# EAGLE design relay_board (EAGLE 7.7.0)
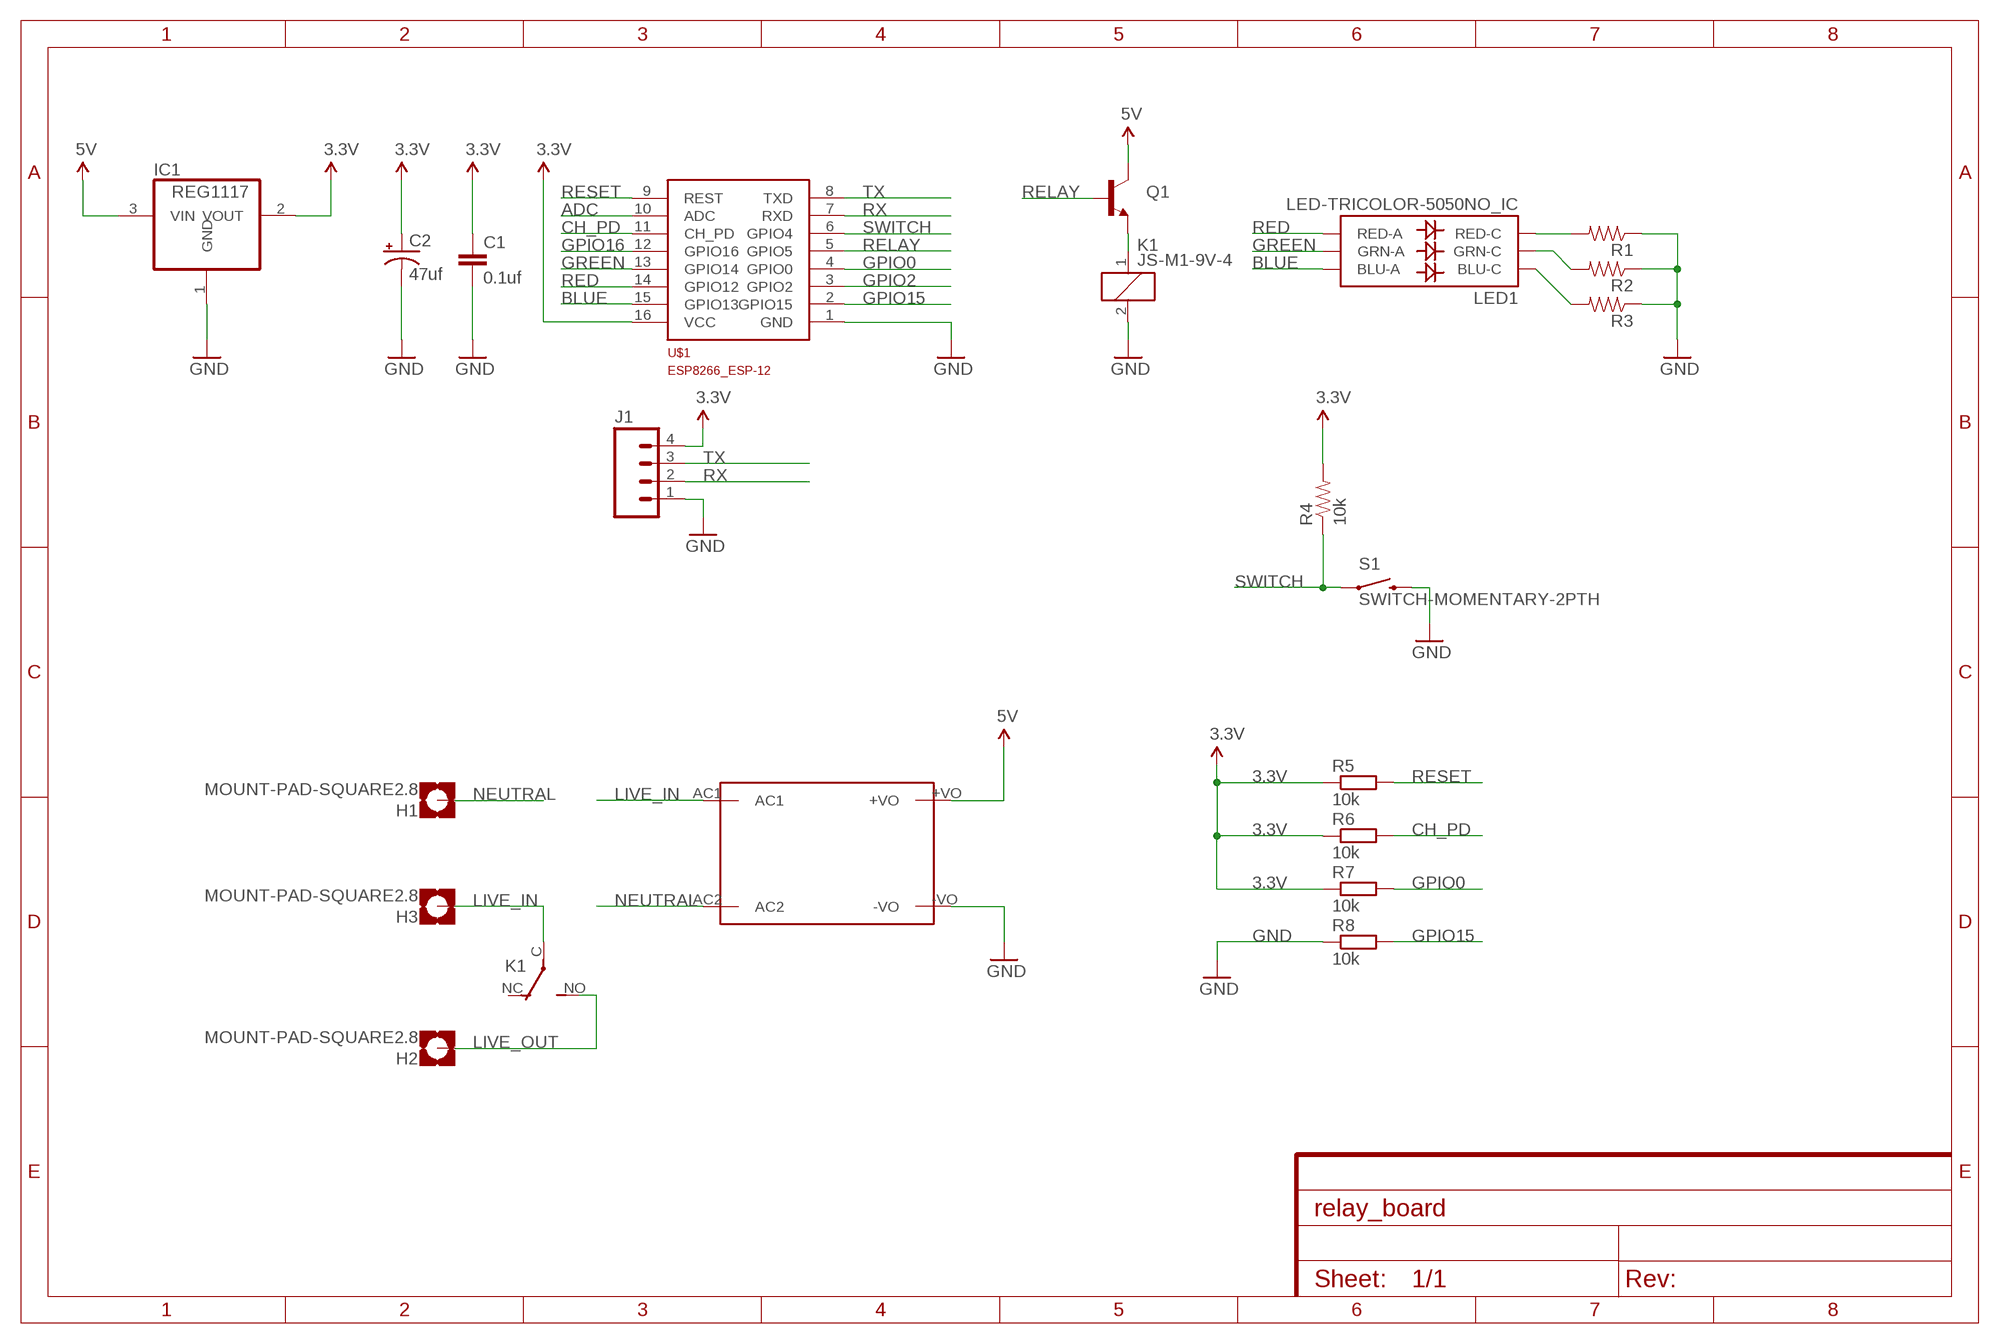
[diagram p0: schematic, sheet 1]

## Parts
C1  0.1uf  CAP0805  [0805]
C2  47uf  CAP_POLE  [PANASONIC_E]
H1  MOUNT-PAD-SQUARE2.8  [2,8-PAD-SQUARE]
H2  MOUNT-PAD-SQUARE2.8  [2,8-PAD-SQUARE]
H3  MOUNT-PAD-SQUARE2.8  [2,8-PAD-SQUARE]
IC1  REG1117  [SOT223]
J1  M04LOCK  [1X04_LOCK]
K1  JS-M1-9V-4  [JS-M]
LED1  LED-TRICOLOR-5050NO_IC  [LED-TRICOLOR-5050]
Q1  TRANSISTOR_NPNSMD2  [SOT223]
R1  RESISTOR0805-RES  [0805]
R2  RESISTOR0805-RES  [0805]
R3  RESISTOR0805-RES  [0805]
R4  10k  RESISTOR0805-RES  [0805]
R5  10k  R-EU_R0805  [R0805]
R6  10k  R-EU_R0805  [R0805]
R7  10k  R-EU_R0805  [R0805]
R8  10k  R-EU_R0805  [R0805]
S1  SWITCH-MOMENTARY-2PTH  [TACTILE-PTH]
U$1  ESP8266_ESP-12  [ESP8266-ESP12]
U$2  HLK-PM03  [HLK-PM03]

## Nets
3.3V: C1.1 C2.+ IC1.2(VOUT) J1.4 R4.2 R5.1 R6.1 R7.1 U$1.16(VCC)
5V: IC1.3(VIN) Q1.2(C) U$2.+VO
ADC: U$1.10(ADC)
BLUE: LED1.3(BLU-A) U$1.15(GPIO13)
CH_PD: R6.2 U$1.11(CH_PD)
GND: C1.2 C2.- IC1.1(GND) J1.1 K1.2 R1.1 R2.1 R3.1 R8.1 S1.3 U$1.1(GND) U$2.-VO
GPIO0: R7.2 U$1.4(GPIO0)
GPIO2: U$1.3(GPIO2)
GPIO15: R8.2 U$1.2(GPIO15)
GPIO16: U$1.12(GPIO16)
GREEN: LED1.1(GRN-A) U$1.13(GPIO14)
LIVE_IN [mains]: H3.B2,8(MOUNT) K1.C(2:P) U$2.AC1
LIVE_OUT [mains]: H2.B2,8(MOUNT) K1.NO(2:S)
N$1: LED1.5(RED-C) R1.2
N$2: LED1.6(GRN-C) R2.2
N$3: LED1.4(BLU-C) R3.2
N$4: K1.1 Q1.3(E)
NEUTRAL [mains]: H1.B2,8(MOUNT) U$2.AC2
RED: LED1.2(RED-A) U$1.14(GPIO12)
RELAY: Q1.1(B) U$1.5(GPIO5)
RESET: R5.2 U$1.9(REST)
RX: J1.2 U$1.7(RXD)
SWITCH: R4.1 S1.1 U$1.6(GPIO4)
TX: J1.3 U$1.8(TXD)
Unconnected: K1.NC(2:O)

## Library data of the parts
C1 = SparkFun-Capacitors:CAP: Capacitor Standard 0603 ceramic capacitor, and 0.1" leaded capacitor.
C2 = SparkFun-Capacitors:CAP_POL: Capacitor Polarized These are standard SMD and PTH capacitors. Normally 10uF, 47uF, and 100uF in electrolytic and tantalum varieties. Always verify the external diameter of the through hole cap, it varies with capacity, voltage, and manufacturer. The EIA devices should be standard.
H1-H3 = holes:MOUNT-PAD-SQUARE: MOUNTING PAD, square
IC1 = burr-brown:REG1117: 800mA and 1A Low Dropout (LDO) Positive Regulator 1.8V, 2.5V, 2.85V, 3.3V, 5V, and Adj; MPN: REG1117; OC_FARNELL: 1097566; OC_NEWARK: 14P6981
J1 = SparkFun-Connectors:M04: Header 4 Standard 4-pin 0.1" header. Use with straight break away headers (SKU : PRT-00116), right angle break away headers (PRT-00553), swiss pins (PRT-00743), machine pins (PRT-00117), and female headers (PRT-00115). Molex polarized connector foot print use with SKU : PRT-08231 with associated crimp pins and housings. 1MM SMD Version SKU: PRT-10208; PROD_ID: CONN-09696
K1 = relay:JS-M1*: Automotive Ultra-Miniature Power Relay NAiS Source: http://www.mew-europe.com/.. en_ds_61211_0000.pdf; OC_FARNELL: unknown; OC_NEWARK: unknown
LED1 = SparkFun-LED:LED-TRICOLOR-5050; PROD_ID: DIO-10298
Q1 = SparkFun-DiscreteSemi:TRANSISTOR_NPN: Generic NPN BJT MMBT2222A - TRANS-08049 (SOT-23, 1A 40V) MPSA42 - TRANS-09116 (SOT-23, 500mA 300V) MMBT5088LT1G - TRANS-11160 (SOT-23, 50 mA 30V) BC547 - COM-08928 <http://www.sparkfun.com/products/8928> (TO-92 45V 100mA) (1.Collector 2.Base 3.Emitter) 2N3904 - COM-00521 <http://www.sparkfun.com/products/521> (TO-92 40V 200mA) (1.Emitter 2.Base 3.Collector) P2N2222A - COM-12852 <http://www.sparkfun.com/products/12852> (TO-92 40V 600mA) (1.Collector 2.Base 3.Emitter)
R1-R4 = SparkFun-Resistors:RESISTOR: Resistor Basic schematic elements and footprints for 0603, 1206, and PTH resistors.
R5-R8 = rcl:R-EU_: RESISTOR, European symbol
S1 = SparkFun-Electromechanical:SWITCH-MOMENTARY-2: Various NO switches- pushbuttons, reed, etc; PROD_ID: SWCH-08441
U$1 = ESP8266-ESP12:ESP8266_ESP-12
U$2 = PowerSocket:HLK-PM03

## Net classes
1 mains: width 2 mm, clearance 1.5 mm

## Board
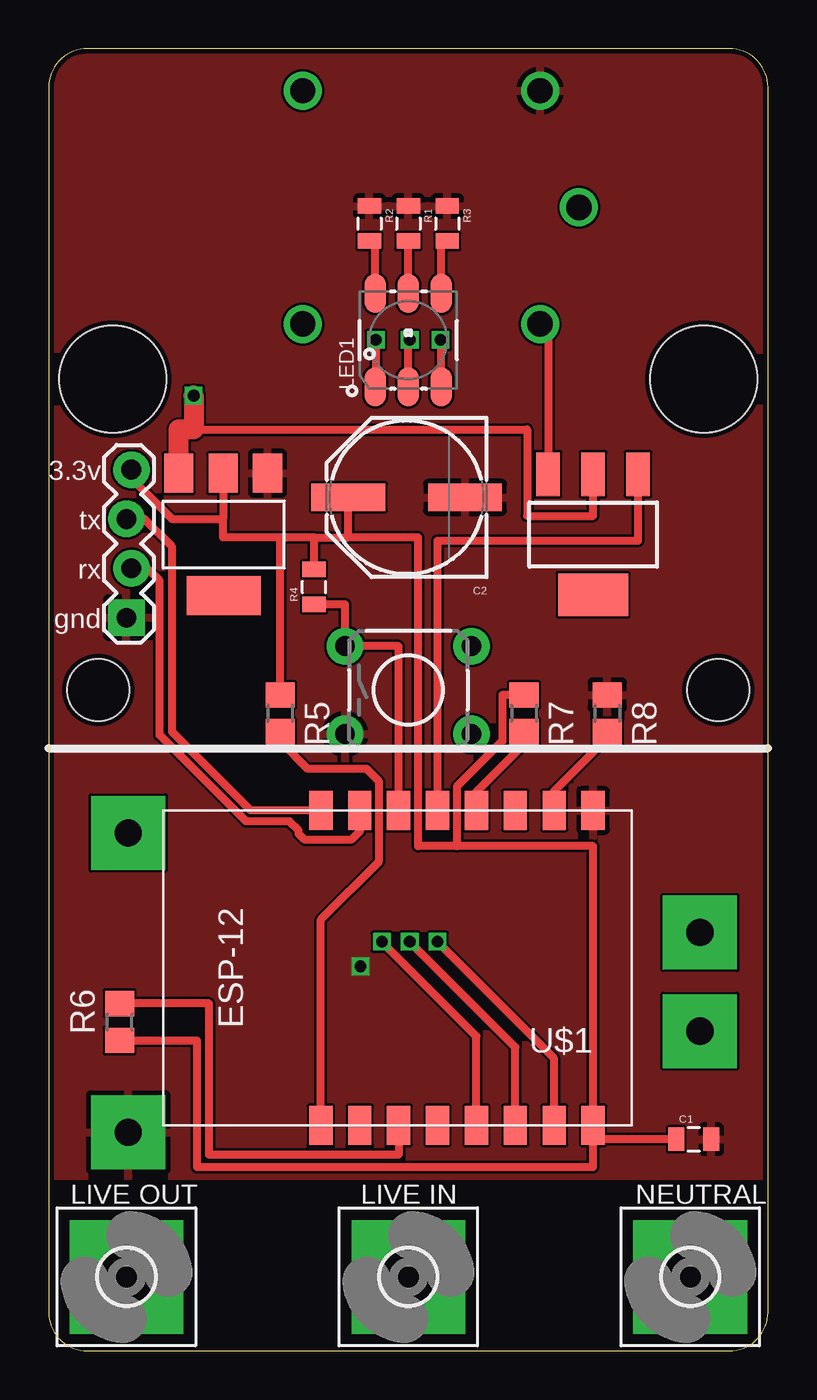
[diagram p1: board, top side]
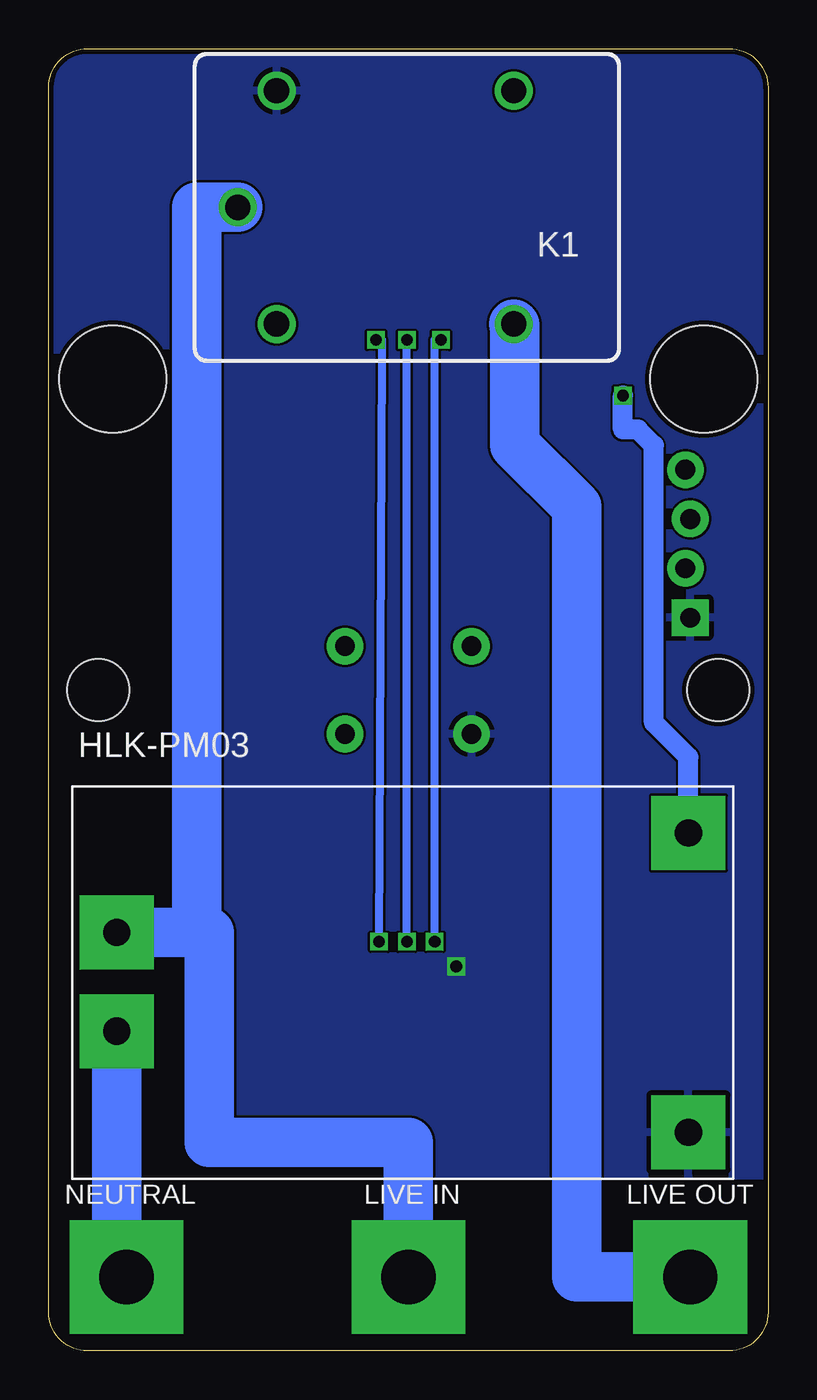
[diagram p2: board, bottom side, seen from below]

Size 37 x 67 mm. Coordinates in mm from the lower left corner, seen from the top.
Outline: 35,67 2,67 arc90 0,65 0,2 arc90 2,0 35,0 arc90 37,2 37,65 arc90 35,67
Copper layers (1*16): Top 0.035mm / dielectric 1.5mm / Bottom 0.035mm
Design rules "dirtypcbs": minimum track width 5mil, minimum drill 12mil, track to track 5mil, track to pad 5mil, pad to pad 5mil, via to via 5mil, smd to smd 0mil, copper to edge 10mil, drill to drill 10mil, minimum pad ring 10mil, minimum via ring 6mil, stop-mask expansion 2mil, vias tented up to drill 25mil, thermal gap 10mil
Holes 3.2 mm at 2.56,34 34.44,34
Holes 5.5 mm at 3.3,50 33.7,50

### Footprints (pad centres in the part's own frame; a part is rotated, then mirrored left to right if it is on the bottom)
0805 = smd 0.8 x 1.2: 1 -0.9,0; 2 0.9,0
PANASONIC_E = smd 3.8 x 1.4: + 3,0; - -3,0
2,8-PAD-SQUARE = drill 2.8 pad 5.842 square: B2,8 0,0
SOT223 = smd 1.499 x 2.007: 1 -2.261,-3.15; 2 0.025,-3.15; 3 2.311,-3.15 | smd 3.81 x 2.007: 4 0,3.15
1X04_LOCK = drill 1.016 pad 1.88 square: 1 0,0.127 | drill 1.016 pad 1.88: 2 2.54,-0.127; 3 5.08,0.127; 4 7.62,-0.127
JS-M = drill 1.3: 1 6.7,6; 2 6.7,-6; C 8.7,0; NC -5.5,-6; NO -5.5,6
LED-TRICOLOR-5050 = smd 2 x 1.1: 1 -2.4,1.7; 2 -2.4,0; 3 -2.4,-1.7; 4 2.4,-1.7; 5 2.4,0; 6 2.4,1.7
SOT223' = smd 1.219 x 2.235: 1 -2.311,-3.099; 2 0,-3.099; 3 2.311,-3.099 | smd 3.6 x 2.2: 4 0,3.099
R0805 = smd 1.3 x 1.5: 1 -0.95,0; 2 0.95,0
TACTILE-PTH = drill 1.016 pad 1.88: 1 -3.251,2.261; 2 3.251,2.261; 3 -3.251,-2.261; 4 3.251,-2.261
ESP8266-ESP12 = smd 2 x 1.2: 1 16.2,2; 2 16.2,4; 3 16.2,6; 4 16.2,8; 5 16.2,10; 6 16.2,12; 7 16.2,14; 8 16.2,16; 9 0,16; 10 0,14; 11 0,12; 12 0,10; 13 0,8; 14 0,6; 15 0,4; 16 0,2
HLK-PM03 = drill 1.4 pad 3.81 square: +VO 29.4,10.2; -VO 29.4,-5.2; AC1 0,5.08; AC2 0,0

### Placement (x,y rotation side)
C1  33.18,10.89 0 top
C2  18.41,43.91 180 top
H1  33,3.81 0 top
H2  4,3.81 0 top
H3  18.5,3.81 0 top
IC1  9,42 180 top
J1  4.13,37.72 90 top
K1  18.57,58.83 180 bottom
LED1  18.5,52 90 top
Q1  [SOT223']  28,42 180 top
R1  18.5,58 270 top
R2  16.5,58 270 top
R3  20.5,58 270 top
R4  13.65,39.31 90 top
R5  11.91,32.8 270 top
R6  3.65,16.92 90 top
R7  24.45,32.8 270 top
R8  28.73,32.8 270 top
S1  18.5,34 0 top
U$1  30,11.61 90 top
U$2  33.5,16.45 0 bottom

### Tracks (layer width: path | path; a pad name or v marks a point on that pad's centre or on a via)
3.3V
  Top 0.406: J1.4 4.25,44.89 6.35,42.8 8.97,42.8 | IC1.2 8.97,42.8 | 13.65,41.85 15.4,41.85 | 15.4,41.85 15.4,43.91 | R4.2 13.65,41.85 | U$1.16 28,25.97 21,25.97 | 21,25.97 19,25.97 19,41.85 15.4,41.85 | 13.65,41.85 11.91,41.85 | 8.97,42.8 8.97,41.85 11.11,41.85 11.91,41.85 | C1.1 28,10.89 U$1.16 | R7.1 23.34,33.75 23.34,31.37 21,29.04 21,25.97 | R6.1 7.62,15.97 7.62,9.46 28,9.46 U$1.16 | R5.1 11.91,41.85
  Top 1.016: 15.4,43.91 C2.+
5V  (via drill 0.6)
  Top 0.406: 7.46,47.4 24.61,47.4 24.61,42.96 28,42.96 Q1.2
  Top 1.016: IC1.3 6.69,47.4 7.46,47.4 v7.46,49.15
  Bottom 1.016: U$2.+VO 4.1,30.54 5.87,32.32 5.87,46.59 6.69,47.4 7.46,47.4 v7.46,49.15
BLUE  (via drill 0.6)
  Top 0.406: U$1.15 26,15.05 v20,21.05 | LED1.3 20.2,52.01 v20.16,52.01
  Bottom 0.406: v20,21.05 19.84,51.21 19.84,52.01 v20.16,52.01
CH_PD
  Top 0.406: U$1.11 18,10.1 8.26,10.1 8.26,17.88 R6.2
GND  (via drill 0.6)
  other vias: 16.03,19.78
  pour Bottom: 0,9 37,9 37,67 0,67
  pour Top: 37,67 0,67 0,9 37,9
GPIO0
  Top 0.406: U$1.4 22,28.77 24.45,31.21 R7.2
GPIO15
  Top 0.406: U$1.2 26,28.8 28.73,31.53 R8.2
GREEN  (via drill 0.6)
  Top 0.406: U$1.13 22,16.19 v17.14,21.05 | v16.83,52.01 16.83,49.63 LED1.1
  Bottom 0.406: v17.14,21.05 17.14,52.01 v16.83,52.01
LIVE_IN
  Bottom 2.54: H3.B2,8 18.5,10.73 28.73,10.73 28.73,21.53 29.37,21.53 | 29.37,21.53 U$2.AC1 | K1.C 29.37,58.83 29.37,21.53
LIVE_OUT
  Bottom 2.54: H2.B2,8 9.84,3.81 9.84,43.43 13.02,46.61 13.02,52.78 K1.NO
N$1
  Top 0.406: LED1.5 R1.2
N$2
  Top 0.406: LED1.6 16.8,57.1 R2.2
N$3
  Top 0.406: LED1.4 20.2,57.1 R3.2
N$4
  Top 0.406: K1.1 25.69,52.83 Q1.3
NEUTRAL
  Bottom 2.54: U$2.AC2 33.5,3.81 H1.B2,8
RED  (via drill 0.6)
  Top 0.406: U$1.14 24,15.62 v18.57,21.05 | LED1.2 18.5,52.01 v18.57,52.01
  Bottom 0.406: v18.57,21.05 v18.57,52.01
RELAY
  Top 0.406: U$1.5 20,41.69 30.32,41.69 30.32,45.1 Q1.1
RESET
  Top 0.406: U$1.9 14,22.19 17,25.19 17,29.29 16.35,29.94 13.34,29.94 11.91,31.37 R5.2
RX
  Top 0.406: U$1.7 16,26.73 15.56,26.29 13.18,26.29 12.86,26.61 12.86,26.77 12.38,27.24 10.16,27.24 5.71,31.69 5.71,39.62 5.08,40.26 J1.2
SWITCH
  Top 0.406: U$1.6 18,36.26 S1.1 15.25,38.41 R4.1
TX
  Top 0.406: U$1.8 10.39,27.81 6.35,31.84 6.35,41.37 4.92,42.8 J1.3

### Text on the board
tNames: 3.3v | tx | rx | gnd | LIVE OUT | LIVE IN | NEUTRAL
bNames: LIVE OUT | LIVE IN | NEUTRAL